# Altium project FPGA1.PrjPcb (part 1 of 2)
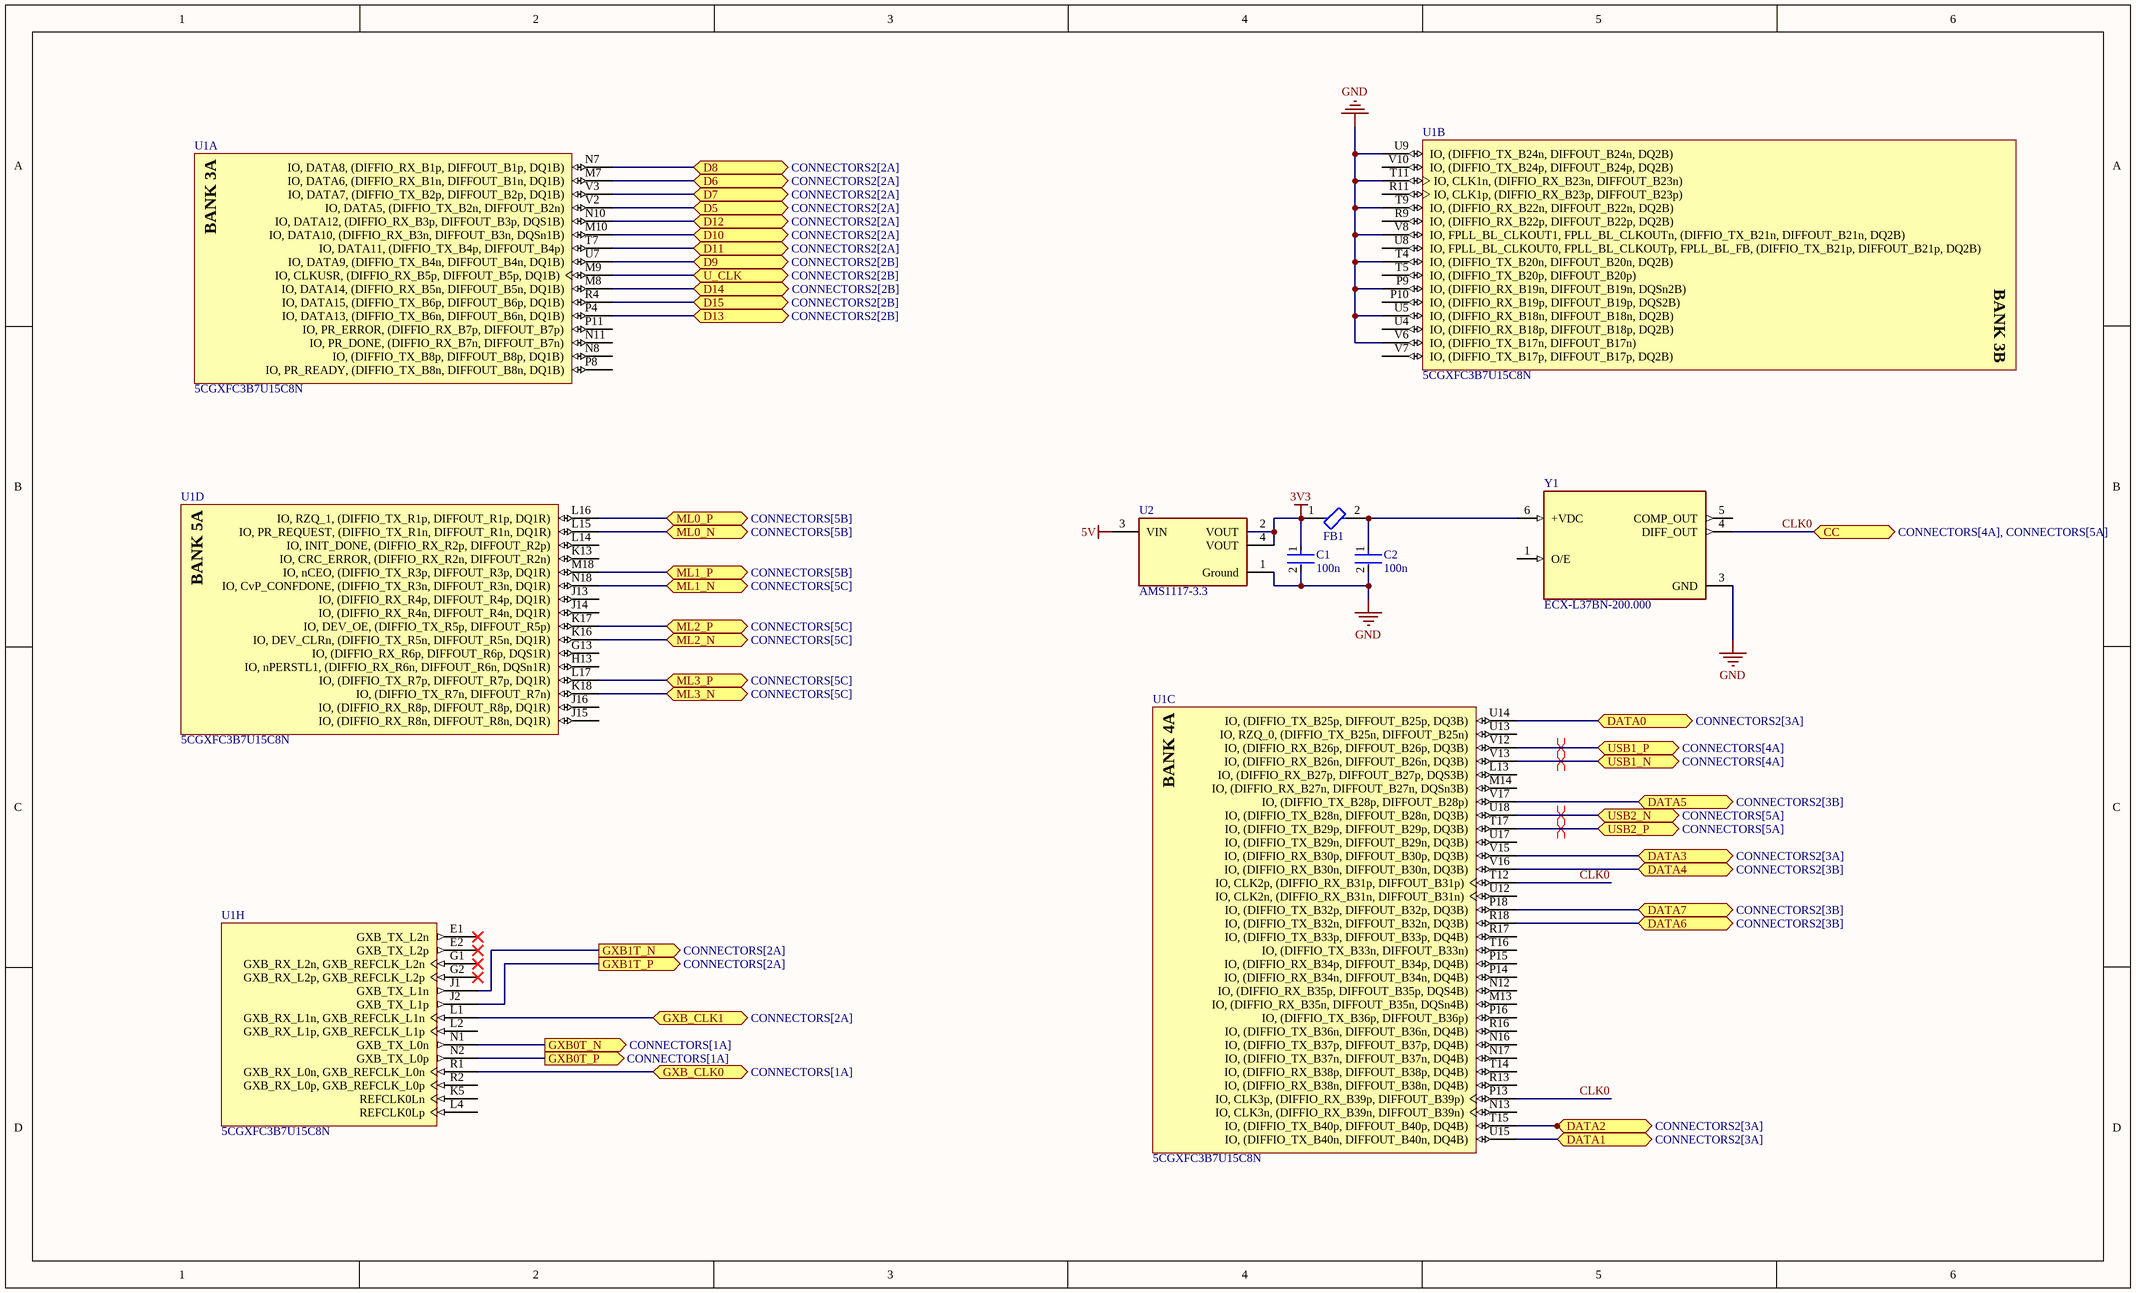
[diagram p0: IO1.SchDoc]
7 sheets, 82 parts. Net scope: flat (ports and power ports of the same name join across sheets).
Board file: cycloneV-board.PcbDoc
Sheets:
  IO1.SchDoc
  POWER1.SchDoc
  IO2.SchDoc
  CONNECTORS2.SchDoc
  sideMICRO.SchDoc
  CONNECTORS.SchDoc
  POWER0.SchDoc

## Sheet IO1.SchDoc
size 400 x 241 mm; SheetNumber: 1; SheetTotal: 7

### Parts
C1  100n  [FP-CL10-IPC_C]
C2  100n  [FP-CL10-IPC_C]
FB1  BLM18KG121TN1D  [FP-BLM18-0_15-t0_6-d1_2-IPC_A]  (value not drawn)
U1  5CGXFC3B7U15C8N  [ALTR-UBGA324_A-150]  (parts A,B,C,D,H of 12)
U2  AMS1117-3.3  [FP-AMS1117-IPC_C]
Y1  ECX-L37BN-200.000  [OSC_ECX-L37BN-200.000]

### Ports
CC (bidir, see CONNECTORS[4A], CONNECTORS[5A]), D5 (bidir, see CONNECTORS2[2A]), D6 (bidir, see CONNECTORS2[2A]), D7 (bidir, see CONNECTORS2[2A]), D8 (bidir, see CONNECTORS2[2A]), D9 (bidir, see CONNECTORS2[2B]), D10 (bidir, see CONNECTORS2[2A]), D11 (bidir, see CONNECTORS2[2A]), D12 (bidir, see CONNECTORS2[2A]), D13 (bidir, see CONNECTORS2[2B]), D14 (bidir, see CONNECTORS2[2B]), D15 (bidir, see CONNECTORS2[2B]), DATA0 (bidir, see CONNECTORS2[3A]), DATA1 (bidir, see CONNECTORS2[3A]), DATA2 (bidir, see CONNECTORS2[3A]), DATA3 (bidir, see CONNECTORS2[3A]), DATA4 (bidir, see CONNECTORS2[3B]), DATA5 (bidir, see CONNECTORS2[3B]), DATA6 (bidir, see CONNECTORS2[3B]), DATA7 (bidir, see CONNECTORS2[3B]), GXB0T_N (out, see CONNECTORS[1A]), GXB0T_P (out, see CONNECTORS[1A]), GXB1T_N (out, see CONNECTORS[2A]), GXB1T_P (out, see CONNECTORS[2A]), GXB_CLK0 (bidir, see CONNECTORS[1A]), GXB_CLK1 (bidir, see CONNECTORS[2A]), ML0_N (bidir, see CONNECTORS[5B]), ML0_P (bidir, see CONNECTORS[5B]), ML1_N (bidir, see CONNECTORS[5C]), ML1_P (bidir, see CONNECTORS[5B]), ML2_N (bidir, see CONNECTORS[5C]), ML2_P (bidir, see CONNECTORS[5C]), ML3_N (bidir, see CONNECTORS[5C]), ML3_P (bidir, see CONNECTORS[5C]), U_CLK (bidir, see CONNECTORS2[2B]), USB1_N (bidir, see CONNECTORS[4A]), USB1_P (bidir, see CONNECTORS[4A]), USB2_N (bidir, see CONNECTORS[5A]), USB2_P (bidir, see CONNECTORS[5A])

### Nets
3V3: C1.1 FB1.1 U2.2(VOUT) U2.4(VOUT)  [project net VCCIO]
5V: U2.3(VIN)
GND: C1.2 C2.2 U1.P9(IO,_(DIFFIO_RX_B19n,_DIFFOUT_B19n,_DQSn2B)) U1.T4(IO,_(DIFFIO_TX_B20n,_DIFFOUT_B20n,_DQ2B)) U1.T9(IO,_(DIFFIO_RX_B22n,_DIFFOUT_B22n,_DQ2B)) U1.T11(IO,_CLK1n,_(DIFFIO_RX_B23n,_DIFFOUT_B23n)) U1.U5(IO,_(DIFFIO_RX_B18n,_DIFFOUT_B18n,_DQ2B)) U1.U9(IO,_(DIFFIO_TX_B24n,_DIFFOUT_B24n,_DQ2B)) U1.V6(IO,_(DIFFIO_TX_B17n,_DIFFOUT_B17n)) U1.V8(IO,_FPLL_BL_CLKOUT1,_FPLL_BL_CLKOUTn,_(DIFFIO_TX_B21n,_DIFFOUT_B21n,_DQ2B)) U2.1(Ground) Y1.3(GND)
CLK0: U1.P13(IO,_CLK3p,_(DIFFIO_RX_B39p,_DIFFOUT_B39p)) U1.T12(IO,_CLK2p,_(DIFFIO_RX_B31p,_DIFFOUT_B31p)) Y1.4(DIFF_OUT) ; port CC
NetC2_1: C2.1 FB1.2 Y1.6(+VDC)
NetJ1_1: U1.P4(IO,_DATA13,_(DIFFIO_TX_B6n,_DIFFOUT_B6n,_DQ1B)) ; port D13
NetJ1_2: U1.R4(IO,_DATA15,_(DIFFIO_TX_B6p,_DIFFOUT_B6p,_DQ1B)) ; port D15
NetJ1_3: U1.M8(IO,_DATA14,_(DIFFIO_RX_B5n,_DIFFOUT_B5n,_DQ1B)) ; port D14
NetJ1_4: U1.M9(IO,_CLKUSR,_(DIFFIO_RX_B5p,_DIFFOUT_B5p,_DQ1B)) ; port U_CLK
NetJ1_5: U1.U7(IO,_DATA9,_(DIFFIO_TX_B4n,_DIFFOUT_B4n,_DQ1B)) ; port D9
NetJ1_6: U1.T7(IO,_DATA11,_(DIFFIO_TX_B4p,_DIFFOUT_B4p)) ; port D11
NetJ1_7: U1.M10(IO,_DATA10,_(DIFFIO_RX_B3n,_DIFFOUT_B3n,_DQSn1B)) ; port D10
NetJ1_8: U1.N10(IO,_DATA12,_(DIFFIO_RX_B3p,_DIFFOUT_B3p,_DQS1B)) ; port D12
NetJ1_9: U1.V2(IO,_DATA5,_(DIFFIO_TX_B2n,_DIFFOUT_B2n)) ; port D5
NetJ1_10: U1.V3(IO,_DATA7,_(DIFFIO_TX_B2p,_DIFFOUT_B2p,_DQ1B)) ; port D7
NetJ1_11: U1.M7(IO,_DATA6,_(DIFFIO_RX_B1n,_DIFFOUT_B1n,_DQ1B)) ; port D6
NetJ1_12: U1.N7(IO,_DATA8,_(DIFFIO_RX_B1p,_DIFFOUT_B1p,_DQ1B)) ; port D8
NetJ2_3: U1.U14(IO,_(DIFFIO_TX_B25p,_DIFFOUT_B25p,_DQ3B)) ; port DATA0
NetJ2_4: U1.U15(IO,_(DIFFIO_TX_B40n,_DIFFOUT_B40n,_DQ4B)) ; port DATA1
NetJ2_5: U1.T15(IO,_(DIFFIO_TX_B40p,_DIFFOUT_B40p,_DQ4B)) ; port DATA2
NetJ2_6: U1.V15(IO,_(DIFFIO_RX_B30p,_DIFFOUT_B30p,_DQ3B)) ; port DATA3
NetJ2_7: U1.V16(IO,_(DIFFIO_RX_B30n,_DIFFOUT_B30n,_DQ3B)) ; port DATA4
NetJ2_8: U1.V17(IO,_(DIFFIO_TX_B28p,_DIFFOUT_B28p)) ; port DATA5
NetJ2_9: U1.R18(IO,_(DIFFIO_TX_B32n,_DIFFOUT_B32n,_DQ3B)) ; port DATA6
NetJ2_10: U1.P18(IO,_(DIFFIO_TX_B32p,_DIFFOUT_B32p,_DQ3B)) ; port DATA7
NetJ5_A5: U1.R1(GXB_RX_L0n,_GXB_REFCLK_L0n) ; port GXB_CLK0
NetJ5_A6: U1.N2(GXB_TX_L0p) ; port GXB0T_P
NetJ5_A7: U1.N1(GXB_TX_L0n) ; port GXB0T_N
NetJ5_B5: U1.L1(GXB_RX_L1n,_GXB_REFCLK_L1n) ; port GXB_CLK1
NetJ5_B6: U1.J2(GXB_TX_L1p) ; port GXB1T_P
NetJ5_B7: U1.J1(GXB_TX_L1n) ; port GXB1T_N
NetJ6_A6: U1.V12(IO,_(DIFFIO_RX_B26p,_DIFFOUT_B26p,_DQ3B)) ; port USB1_P
NetJ6_A7: U1.V13(IO,_(DIFFIO_RX_B26n,_DIFFOUT_B26n,_DQ3B)) ; port USB1_N
NetJ6_B6: U1.T17(IO,_(DIFFIO_TX_B29p,_DIFFOUT_B29p,_DQ3B)) ; port USB2_P
NetJ6_B7: U1.U18(IO,_(DIFFIO_TX_B28n,_DIFFOUT_B28n,_DQ3B)) ; port USB2_N
NetJ7_1: U1.L16(IO,_RZQ_1,_(DIFFIO_TX_R1p,_DIFFOUT_R1p,_DQ1R)) ; port ML0_P
NetJ7_3: U1.L15(IO,_PR_REQUEST,_(DIFFIO_TX_R1n,_DIFFOUT_R1n,_DQ1R)) ; port ML0_N
NetJ7_4: U1.M18(IO,_nCEO,_(DIFFIO_TX_R3p,_DIFFOUT_R3p,_DQ1R)) ; port ML1_P
NetJ7_6: U1.N18(IO,_CvP_CONFDONE,_(DIFFIO_TX_R3n,_DIFFOUT_R3n,_DQ1R)) ; port ML1_N
NetJ7_7: U1.K17(IO,_DEV_OE,_(DIFFIO_TX_R5p,_DIFFOUT_R5p)) ; port ML2_P
NetJ7_9: U1.K16(IO,_DEV_CLRn,_(DIFFIO_TX_R5n,_DIFFOUT_R5n,_DQ1R)) ; port ML2_N
NetJ7_10: U1.L17(IO,_(DIFFIO_TX_R7p,_DIFFOUT_R7p,_DQ1R)) ; port ML3_P
NetJ7_12: U1.K18(IO,_(DIFFIO_TX_R7n,_DIFFOUT_R7n)) ; port ML3_N

Not connected (* = marked no-connect by the designer): U1 E1(GXB_TX_L2n)* E2(GXB_TX_L2p)* G1(GXB_RX_L2n,_GXB_REFCLK_L2n)* G2(GXB_RX_L2p,_GXB_REFCLK_L2p)* G13(IO,_(DIFFIO_RX_R6p,_DIFFOUT_R6p,_DQS1R)) H13(IO,_nPERSTL1,_(DIFFIO_RX_R6n,_DIFFOUT_R6n,_DQSn1R)) J13(IO,_(DIFFIO_RX_R4p,_DIFFOUT_R4p,_DQ1R)) J14(IO,_(DIFFIO_RX_R4n,_DIFFOUT_R4n,_DQ1R)) J15(IO,_(DIFFIO_RX_R8n,_DIFFOUT_R8n,_DQ1R)) J16(IO,_(DIFFIO_RX_R8p,_DIFFOUT_R8p,_DQ1R)) K5(REFCLK0Ln) K13(IO,_CRC_ERROR,_(DIFFIO_RX_R2n,_DIFFOUT_R2n)) L2(GXB_RX_L1p,_GXB_REFCLK_L1p) L4(REFCLK0Lp) L13(IO,_(DIFFIO_RX_B27p,_DIFFOUT_B27p,_DQS3B)) L14(IO,_INIT_DONE,_(DIFFIO_RX_R2p,_DIFFOUT_R2p)) M13(IO,_(DIFFIO_RX_B35n,_DIFFOUT_B35n,_DQSn4B)) M14(IO,_(DIFFIO_RX_B27n,_DIFFOUT_B27n,_DQSn3B)) N8(IO,_(DIFFIO_TX_B8p,_DIFFOUT_B8p,_DQ1B)) N11(IO,_PR_DONE,_(DIFFIO_RX_B7n,_DIFFOUT_B7n)) N12(IO,_(DIFFIO_RX_B35p,_DIFFOUT_B35p,_DQS4B)) N13(IO,_CLK3n,_(DIFFIO_RX_B39n,_DIFFOUT_B39n)) N16(IO,_(DIFFIO_TX_B37p,_DIFFOUT_B37p,_DQ4B)) N17(IO,_(DIFFIO_TX_B37n,_DIFFOUT_B37n,_DQ4B)) P8(IO,_PR_READY,_(DIFFIO_TX_B8n,_DIFFOUT_B8n,_DQ1B)) P10(IO,_(DIFFIO_RX_B19p,_DIFFOUT_B19p,_DQS2B)) P11(IO,_PR_ERROR,_(DIFFIO_RX_B7p,_DIFFOUT_B7p)) P14(IO,_(DIFFIO_RX_B34n,_DIFFOUT_B34n,_DQ4B)) P15(IO,_(DIFFIO_RX_B34p,_DIFFOUT_B34p,_DQ4B)) P16(IO,_(DIFFIO_TX_B36p,_DIFFOUT_B36p)) R2(GXB_RX_L0p,_GXB_REFCLK_L0p) R9(IO,_(DIFFIO_RX_B22p,_DIFFOUT_B22p,_DQ2B)) R11(IO,_CLK1p,_(DIFFIO_RX_B23p,_DIFFOUT_B23p)) R13(IO,_(DIFFIO_RX_B38n,_DIFFOUT_B38n,_DQ4B)) R16(IO,_(DIFFIO_TX_B36n,_DIFFOUT_B36n,_DQ4B)) R17(IO,_(DIFFIO_TX_B33p,_DIFFOUT_B33p,_DQ4B)) T5(IO,_(DIFFIO_TX_B20p,_DIFFOUT_B20p)) T14(IO,_(DIFFIO_RX_B38p,_DIFFOUT_B38p,_DQ4B)) T16(IO,_(DIFFIO_TX_B33n,_DIFFOUT_B33n)) U4(IO,_(DIFFIO_RX_B18p,_DIFFOUT_B18p,_DQ2B)) U8(IO,_FPLL_BL_CLKOUT0,_FPLL_BL_CLKOUTp,_FPLL_BL_FB,_(DIFFIO_TX_B21p,_DIFFOUT_B21p,_DQ2B)) U12(IO,_CLK2n,_(DIFFIO_RX_B31n,_DIFFOUT_B31n)) U13(IO,_RZQ_0,_(DIFFIO_TX_B25n,_DIFFOUT_B25n)) U17(IO,_(DIFFIO_TX_B29n,_DIFFOUT_B29n,_DQ3B)) V7(IO,_(DIFFIO_TX_B17p,_DIFFOUT_B17p,_DQ2B)) V10(IO,_(DIFFIO_TX_B24p,_DIFFOUT_B24p,_DQ2B)); Y1 1(O/E) 5(COMP_OUT)

### Layout directives
differential pair: NetJ6_A6, NetJ6_A7, NetJ6_B6, NetJ6_B7

### Notes on the sheet
- (in symbol CMP-0469-00059-2, part A) BANK 3A
- (in symbol CMP-0469-00059-2, part B) BANK 3B
- (in symbol CMP-0469-00059-2, part C) BANK 4A
- (in symbol CMP-0469-00059-2, part D) BANK 5A

### Library data of the parts
C1 C2 = CMP-13271-003017-1: Cap Ceramic 4.7uF 10V X5R ±10% Pad SMD 0603 +85°C T/R; Capacitance: 4.7uF; Case/Package: 0603; Packaging: Tape and Reel; Width: 0.031inch; Contact Plating: Tin; Thickness: 0.035inch; Package Quantity: 1; Voltage Rating: 10V; Case Code (Metric): 1608; Case Code (Imperial): 0603; Depth: 0.8mm; Height: 0.8mm; Tolerance: 10%; Max Operating Temperature: 85°C; Length: 1.6mm; Dielectric: X5R; Mount: Surface Mount; Radiation Hardening: No; Min Operating Temperature: -55°C
FB1 = CMP-0686-00554-8: FERRITE BEAD 120 OHM 0603 1LN; Max Current Rating: 3A; DC Resistance (DCR): 30mR; Impedance: 120R; Number of Lines: 1; Test Frequency: 100MHz; Tolerance: 25%; Package Quantity: 4000; Min Operating Temperature: -55°C; Termination: SMD/SMT; REACH SVHC: No SVHC; Core Material: Ferrite; Material: Ferrite; Current Rating: 3A; Height: 0.8mm; Number of Pins: 2; Case/Package: 0603; Case Code (Imperial): 0603; Series: BLM18K; Packaging: Tape and Reel; Inductor Type: FERRITE BEAD; Lead Free: Lead Free; Width: 0.8mm; Case Code (Metric): 1608; Number of Circuits: 1; Max DC Current: 3A; Depth: 0.95mm; Max Operating Temperature: 125°C; Length: 1.6mm; RoHS Compliant: Yes
U1 = CMP-0469-00059-2: Cyclone V GX Family FPGA, 1.07 to 1.13 V Supply, 144 I/O Pins, 4 PLLs, 324-Pin UBGA, Speed Grade 8, Commercial Grade, RoHS Compliant; Manufacturer: Altera; Logic Elements (LE) (K): 31.5; GPIO: 144; Speed Grade: 8; ComponentLink1Description: Manufacturer URL; ComponentLink5URL: http://www.altera.com/literature/dp/cyclone-v/5CGXFC3.xls; ComponentLink7URL: http://www.buyaltera.com/scripts/partsearch.dll?Detail&name=544-2758-ND; Subcategory: Cyclone V GX; ComponentLink2Description: Datasheet; Voltage Supply: 1.07 to 1.13 V; PackageVersion: Rev. 1.0, 10/2011; ComponentLink7Description: Product URL; ComponentLink4Description: Device Handbook URL; Mounting Technology: Surface Mount; ComponentLink3URL: http://www.altera.com/devicepackaging/04R00433-00.pdf; Code_JEDEC: MO-216-BAK-1; ComponentLink1URL: http://www.altera.com; ComponentLink3Description: Package Specification; Device Group: 5CGXFC3; ComponentLink6URL: http://www.altera.com/literature/hb/cyclone-v/cv_51001.pdf; ComponentLink4URL: http://www.altera.com/literature/hb/cyclone-v/cyclone5_handbook.pdf; PackageDescription: 324-Pin Ultra FineLine Ball-Grid Array (UBGA), Body 15 x 15 mm, Pitch 0.8 mm; RoHS: RoHS Compliant; PackageReference: UBGA324_A-150; DatasheetVersion: Rev. 3.4; PartNumber: 5CGXFC3B7U15C8N; ComponentLink2URL: http://www.altera.com/literature/hb/cyclone-v/cv_51002.pdf; ComponentLink6Description: Device Overview URL; ComponentLink5Description: Device Pin-Out URL; NexusDeviceID: 5CGXFC3B7U15C8N
U2 = CMP-209535-000001-1: LDO Voltage Regulators 1A, 3.3V; Manufacturer: Advanced Monolithic Systems; Dropout Voltage: 1.1V; Output Type: Fixed; Nominal Supply Current: 5mA; Max Power Dissipation: 1.2W; Max Supply Voltage: 15V; Number Of Outputs: 1; Standoff Height: 0.64mm; Max Junction Temp: +125°C; Height: 1.8mm; Package: AMS1117; Device Class L2: Power Management ICs; ComponentLink2Description: Datasheet; ComponentLink2URL: http://www.advanced-monolithic.com/pdf/ds1117.pdf; Category: IC; RoHS: TRUE; Automotive: No; Device Class L1: Integrated Circuits (ICs); Output Current: 1A; Device Class L3: Voltage Regulators - Linear; Temperature: -40°C to +125°C; Output Voltage: 3.3V; Manufacturer Part Number: AMS1117-3.3; Temperature Range Low: -40°C; Octopart: https://octopart.com/ams1117-3.3-advanced+monolithic+systems-25899300; Lead Free: Yes; Ipc Land Pattern Name: SOT229P700X180-4; Temperature Range High: +125°C
Y1 = ECX-L37BN-200.000: 200 MHz XO (Standard) LVDS Oscillator 3.3V Enable/Disable 6-SMD, No Lead; MF: ECS Inc.; MP: ECX-L37BN-200.000; Package: SMD-6 ECS International; Purchase-URL: https://pricing.snapeda.com/search/part/ECX-L37BN-200.000/?ref=eda; Price: None; Value: *; SnapEDA_Link: https://www.snapeda.com/parts/ECX-L37BN-200.000/ECS+Inc./view-part/?ref=snap; Check_prices: https://www.snapeda.com/parts/ECX-L37BN-200.000/ECS+Inc./view-part/?ref=eda; Availability: In Stock

## Sheet POWER1.SchDoc
size A; SheetNumber: 2; SheetTotal: 7
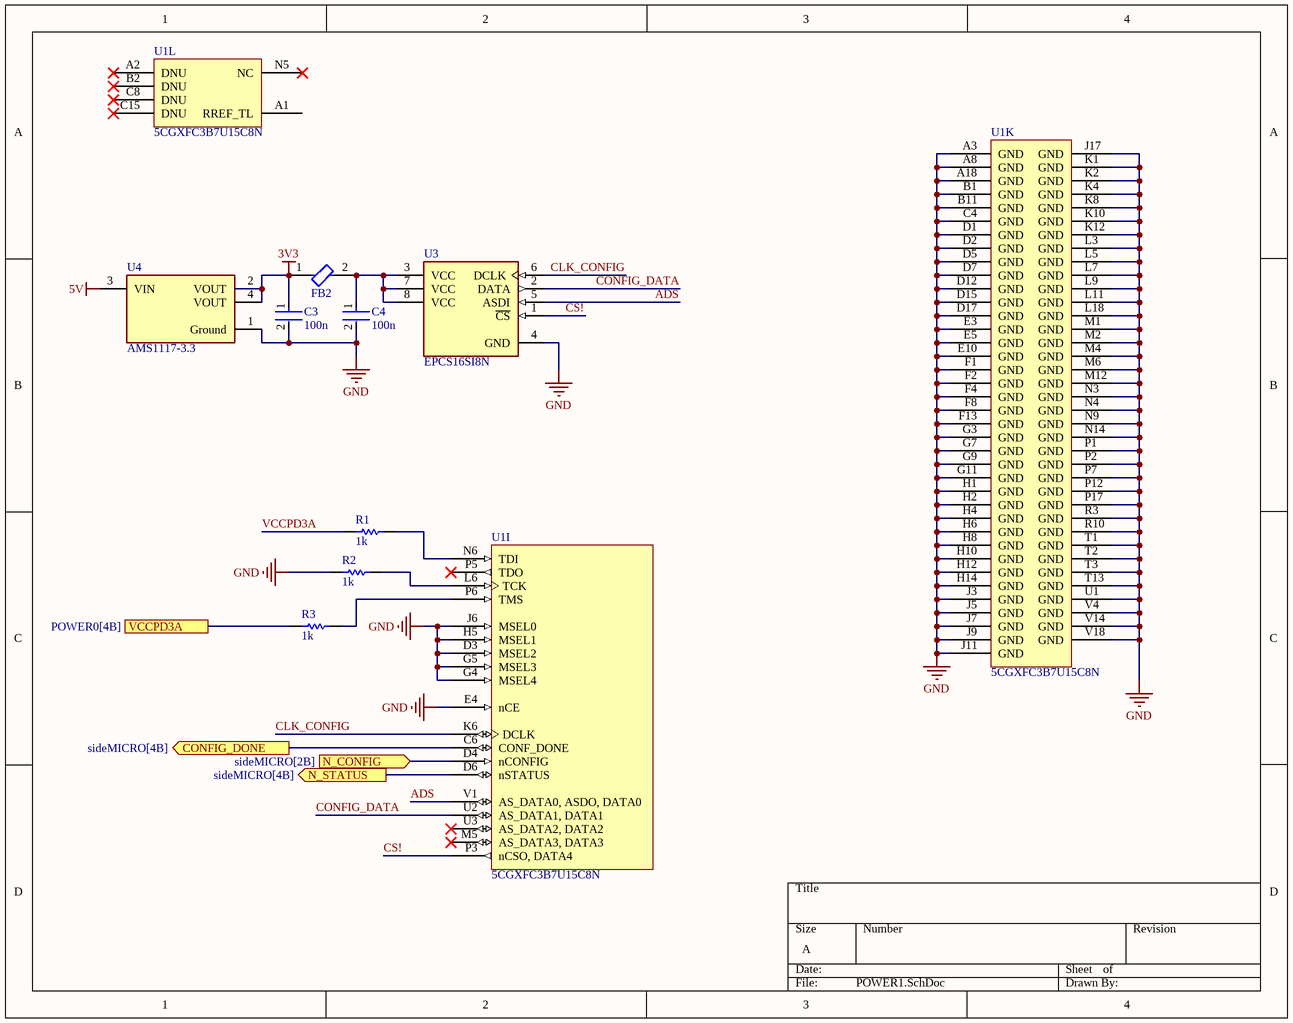
[diagram p1: POWER1.SchDoc]

### Parts
C3  100n  [FP-CL10-IPC_C]
C4  100n  [FP-CL10-IPC_C]
FB2  BLM18KG121TN1D  [FP-BLM18-0_15-t0_6-d1_2-IPC_A]  (value not drawn)
R1  1k  [RESC2013X60X35ML10T20]
R2  1k  [RESC2013X60X35ML10T20]
R3  1k  [RESC2013X60X35ML10T20]
U1  5CGXFC3B7U15C8N  [ALTR-UBGA324_A-150]  (parts I,K,L of 12)
U3  EPCS16SI8N  [FP-SOIC-8-IPC_C]
U4  AMS1117-3.3  [FP-AMS1117-IPC_C]

### Ports
CONFIG_DONE (out, see sideMICRO[4B]), N_CONFIG (in, see sideMICRO[2B]), N_STATUS (out, see sideMICRO[4B]), VCCPD3A (see POWER0[4B])

### Nets
3V3: C3.1 FB2.1 U4.2(VOUT) U4.4(VOUT)  [project net VCCIO]
5V: U4.3(VIN)
GND: C3.2 C4.2 R2.1 U1.A3(GND) U1.A8(GND) U1.A18(GND) U1.B1(GND) U1.B11(GND) U1.C4(GND) U1.D1(GND) U1.D2(GND) U1.D3(MSEL2) U1.D5(GND) U1.D7(GND) U1.D12(GND) U1.D15(GND) U1.D17(GND) U1.E3(GND) U1.E4(nCE) U1.E5(GND) U1.E10(GND) U1.F1(GND) U1.F2(GND) U1.F4(GND) U1.F8(GND) U1.F13(GND) U1.G3(GND) U1.G4(MSEL4) U1.G5(MSEL3) U1.G7(GND) U1.G9(GND) U1.G11(GND) U1.H1(GND) U1.H2(GND) U1.H4(GND) U1.H5(MSEL1) U1.H6(GND) U1.H8(GND) U1.H10(GND) U1.H12(GND) U1.H14(GND) U1.J3(GND) U1.J5(GND) U1.J6(MSEL0) U1.J7(GND) U1.J9(GND) U1.J11(GND) U1.J17(GND) U1.K1(GND) U1.K2(GND) U1.K4(GND) U1.K8(GND) U1.K10(GND) U1.K12(GND) U1.L3(GND) U1.L5(GND) U1.L7(GND) U1.L9(GND) U1.L11(GND) U1.L18(GND) U1.M1(GND) U1.M2(GND) U1.M4(GND) U1.M6(GND) U1.M12(GND) U1.N3(GND) U1.N4(GND) U1.N9(GND) U1.N14(GND) U1.P1(GND) U1.P2(GND) U1.P7(GND) U1.P12(GND) U1.P17(GND) U1.R3(GND) U1.R10(GND) U1.T1(GND) U1.T2(GND) U1.T3(GND) U1.T13(GND) U1.U1(GND) U1.V4(GND) U1.V14(GND) U1.V18(GND) U3.4(GND) U4.1(Ground)
ADS: U1.V1(AS_DATA0,_ASDO,_DATA0) U3.5(ASDI)
CLK_CONFIG: U1.K6(DCLK) U3.6(DCLK)
CONFIG_DATA: U1.U2(AS_DATA1,_DATA1) U3.2(DATA)
CS!: U1.P3(nCSO,_DATA4) U3.1(~{CS})
VCCPD3A: R1.1
NetC4_1: C4.1 FB2.2 U3.3(VCC) U3.7(VCC) U3.8(VCC)
NetR1_2: R1.2 U1.N6(TDI)
NetR2_2: R2.2 U1.L6(TCK)
NetR3_1: R3.1 ; port VCCPD3A
NetR3_2: R3.2 U1.P6(TMS)
NetU1_C6: U1.C6(CONF_DONE) ; port CONFIG_DONE
NetU1_D4: U1.D4(nCONFIG) ; port N_CONFIG
NetU1_D6: U1.D6(nSTATUS) ; port N_STATUS

Not connected (* = marked no-connect by the designer): U1 A1(RREF_TL) A2(DNU)* B2(DNU)* C8(DNU)* C15(DNU)* M5(AS_DATA3,_DATA3)* N5(NC)* P5(TDO)* U3(AS_DATA2,_DATA2)*

### Library data of the parts
C3 C4 = CMP-13271-003017-1: as C1 on sheet IO1; Capacitance: 4.7uF; Case/Package: 0603; Packaging: Tape and Reel; Width: 0.031inch; Contact Plating: Tin; Thickness: 0.035inch; Package Quantity: 1; Voltage Rating: 10V; Case Code (Metric): 1608; Case Code (Imperial): 0603; Depth: 0.8mm; Height: 0.8mm; Tolerance: 10%; Max Operating Temperature: 85°C; Length: 1.6mm; Dielectric: X5R; Mount: Surface Mount; Radiation Hardening: No; Min Operating Temperature: -55°C
FB2 = CMP-0686-00554-8: as FB1 on sheet IO1; Package Quantity: 4000; Min Operating Temperature: -55°C; Termination: SMD/SMT; REACH SVHC: No SVHC; Core Material: Ferrite; Material: Ferrite; Current Rating: 3A; Height: 0.8mm; Number of Pins: 2; Case/Package: 0603; Case Code (Imperial): 0603; Series: BLM18K; Packaging: Tape and Reel; Inductor Type: FERRITE BEAD; Lead Free: Lead Free; Width: 0.8mm; Case Code (Metric): 1608; Number of Circuits: 1; Max DC Current: 3A; Depth: 0.95mm; Max Operating Temperature: 125°C; Length: 1.6mm; RoHS Compliant: Yes
R1-R3 = CMP-2100-03673-1: Chip Resistor, 0 Ohm, Jumper, +/- 5%, 0.125 W, -55 to 155 degC, 0805 (2012 Metric), RoHS, Tape and Reel; Manufacturer: Yageo; Power Rating: 125mW; Resistance: 0mOhm; Voltage Rating (DC): 150V; Temperature Coefficient: 200ppm/degreesC; Height: 0.5mm; Depth: 1.25mm; Case Code (Imperial): 0805; Lead Free: LeadFree; Military Standard: Not; Package Description: 2-Pin Surface Mounted Device, Body 2 x 1.25 mm; Case Code (Metric): 2012; Composition: ThickFilm; Voltage Rating: 150V; Manufacturer URL: http://www.yageo.com/; Packaging: TapeandReel; Package Reference: 0805; REACH SVHC: Unknown; Tolerance: 5%; Case/Package: 0805; Max Operating Temperature: 155degC; Number of Pins: 2; Min Operating Temperature: -55degC; RoHSCompliant: true; Length: 2mm; Datasheet URL: http://www.yageo.com/NewPortal/yageodocoutput?fileName=/pdf/R-Chip/PYu-RC_Group_51_RoHS_L_5.pdf; Termination: SMD/SMT; Radiation Hardening: No; Width: 1.25mm; Contact Plating: Tin; Datasheet Version: Rev. 5, 10/2016
U1 = CMP-0469-00059-2: as U1 on sheet IO1; ComponentLink1Description: Manufacturer URL; ComponentLink5URL: http://www.altera.com/literature/dp/cyclone-v/5CGXFC3.xls; ComponentLink7URL: http://www.buyaltera.com/scripts/partsearch.dll?Detail&name=544-2758-ND; Subcategory: Cyclone V GX; ComponentLink2Description: Datasheet; Voltage Supply: 1.07 to 1.13 V; PackageVersion: Rev. 1.0, 10/2011; ComponentLink7Description: Product URL; ComponentLink4Description: Device Handbook URL; Mounting Technology: Surface Mount; ComponentLink3URL: http://www.altera.com/devicepackaging/04R00433-00.pdf; Code_JEDEC: MO-216-BAK-1; ComponentLink1URL: http://www.altera.com; ComponentLink3Description: Package Specification; Device Group: 5CGXFC3; ComponentLink6URL: http://www.altera.com/literature/hb/cyclone-v/cv_51001.pdf; ComponentLink4URL: http://www.altera.com/literature/hb/cyclone-v/cyclone5_handbook.pdf; PackageDescription: 324-Pin Ultra FineLine Ball-Grid Array (UBGA), Body 15 x 15 mm, Pitch 0.8 mm; RoHS: RoHS Compliant; PackageReference: UBGA324_A-150; DatasheetVersion: Rev. 3.4; PartNumber: 5CGXFC3B7U15C8N; ComponentLink2URL: http://www.altera.com/literature/hb/cyclone-v/cv_51002.pdf; ComponentLink6Description: Device Overview URL; ComponentLink5Description: Device Pin-Out URL; NexusDeviceID: 5CGXFC3B7U15C8N
U3 = CMP-0215-00002-2: IC CONFIG DEVICE 16MBIT 8SOIC; Manufacturer: Intel; Obsolete Part: true; Interface: Other; Memory Type: FLASH; Nominal Supply Current: 15-20mA; Min Supply Voltage: 2.7V; Memory Size: 16Mbits; Max Junction Temp: +135°C; Standoff Height: 0.1mm; Frequency: 40MHz; Max Supply Voltage: 3.6V; Device Class L1: Integrated Circuits (ICs); Ambient Temperature Range Low: -40°C; Automotive: No; Ipc Land Pattern Name: SOIC127P600X155-8; Lead Free: Yes; Height: 1.75mm; Device Class L3: Flash; Temperature Range High: +135°C; Ambient Temperature Range High: +85°C; Manufacturer Part Number: EPCS16SI8N; ComponentLink2URL: https://www.intel.com/content/dam/www/programmable/us/en/pdfs/literature/hb/cfg/cyc_c51014.pdf; RoHS: TRUE; ComponentLink2Description: Datasheet; Digikey Description: IC CONFIG DEVICE 16MBIT 8SOIC; Octopart: https://octopart.com/epcs16si8n-intel-80907697; Package: SOIC-8; Temperature: to +135°C; Device Class L2: Memory; Footprint Url: https://www.intel.com/content/dam/www/programmable/us/en/pdfs/literature/packaging/04r00424-00.pdf; Category: IC; Mouser Description: FPGA - Configuration Memory IC - Ser. Config Mem Flash 16Mb 40 MHz
U4 = CMP-209535-000001-1: as U2 on sheet IO1; Height: 1.8mm; Package: AMS1117; Device Class L2: Power Management ICs; ComponentLink2Description: Datasheet; ComponentLink2URL: http://www.advanced-monolithic.com/pdf/ds1117.pdf; Category: IC; RoHS: TRUE; Automotive: No; Device Class L1: Integrated Circuits (ICs); Output Current: 1A; Device Class L3: Voltage Regulators - Linear; Temperature: -40°C to +125°C; Output Voltage: 3.3V; Manufacturer Part Number: AMS1117-3.3; Temperature Range Low: -40°C; Octopart: https://octopart.com/ams1117-3.3-advanced+monolithic+systems-25899300; Lead Free: Yes; Ipc Land Pattern Name: SOT229P700X180-4; Temperature Range High: +125°C

## Sheet IO2.SchDoc
size 359 x 219 mm; SheetNumber: 3; SheetTotal: 7
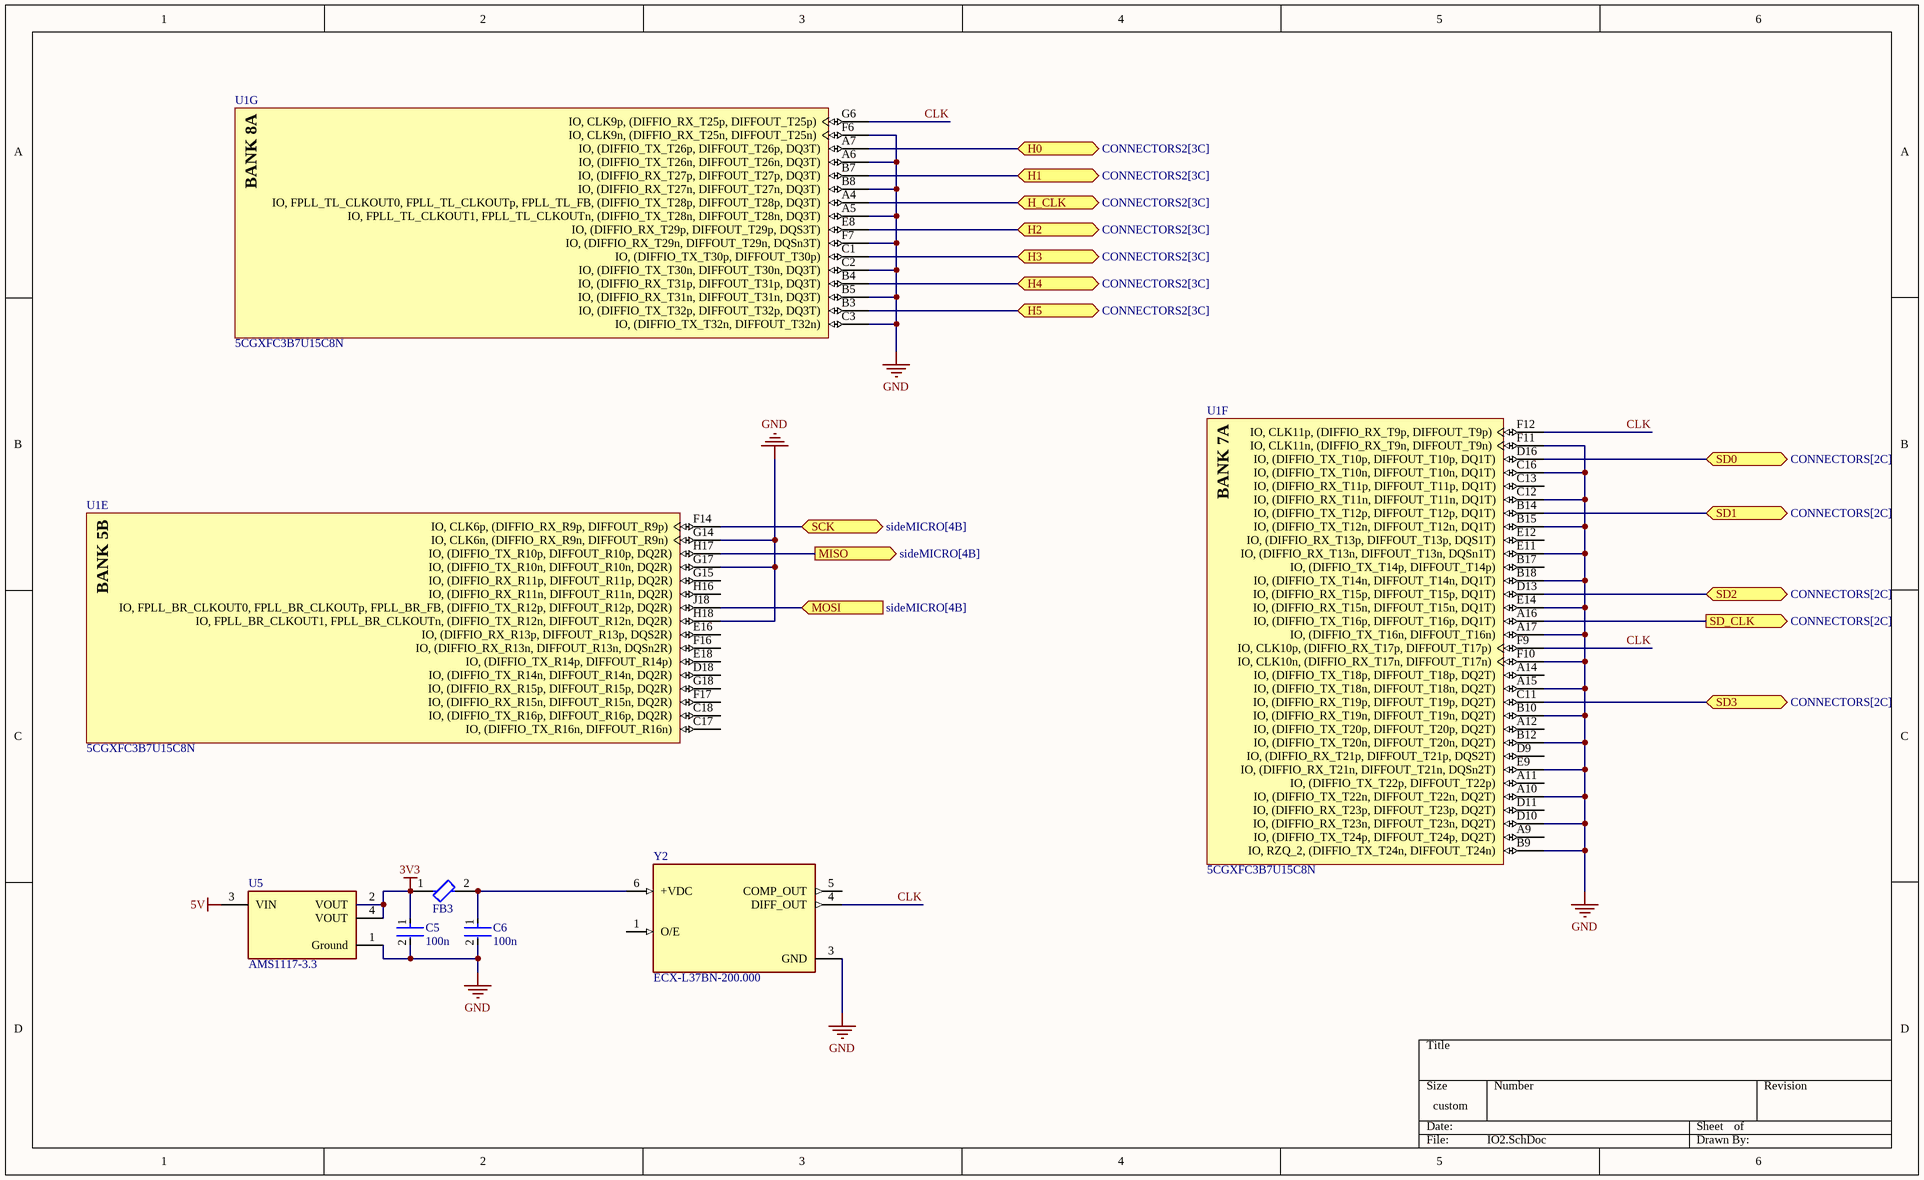
[diagram p2: IO2.SchDoc]

### Parts
C5  100n  [FP-CL10-IPC_C]
C6  100n  [FP-CL10-IPC_C]
FB3  BLM18KG121TN1D  [FP-BLM18-0_15-t0_6-d1_2-IPC_A]  (value not drawn)
U1  5CGXFC3B7U15C8N  [ALTR-UBGA324_A-150]  (parts E,F,G of 12)
U5  AMS1117-3.3  [FP-AMS1117-IPC_C]
Y2  ECX-L37BN-200.000  [OSC_ECX-L37BN-200.000]

### Ports
H0 (bidir, see CONNECTORS2[3C]), H1 (bidir, see CONNECTORS2[3C]), H2 (bidir, see CONNECTORS2[3C]), H3 (bidir, see CONNECTORS2[3C]), H4 (bidir, see CONNECTORS2[3C]), H5 (bidir, see CONNECTORS2[3C]), H_CLK (bidir, see CONNECTORS2[3C]), MISO (out, see sideMICRO[4B]), MOSI (in, see sideMICRO[4B]), SCK (bidir, see sideMICRO[4B]), SD0 (bidir, see CONNECTORS[2C]), SD1 (bidir, see CONNECTORS[2C]), SD2 (bidir, see CONNECTORS[2C]), SD3 (bidir, see CONNECTORS[2C]), SD_CLK (out, see CONNECTORS[2C])

### Nets
3V3: C5.1 FB3.1 U5.2(VOUT) U5.4(VOUT)  [project net VCCIO]
5V: U5.3(VIN)
GND: C5.2 C6.2 U1.A5(IO,_FPLL_TL_CLKOUT1,_FPLL_TL_CLKOUTn,_(DIFFIO_TX_T28n,_DIFFOUT_T28n,_DQ3T)) U1.A6(IO,_(DIFFIO_TX_T26n,_DIFFOUT_T26n,_DQ3T)) U1.A10(IO,_(DIFFIO_TX_T22n,_DIFFOUT_T22n,_DQ2T)) U1.A15(IO,_(DIFFIO_TX_T18n,_DIFFOUT_T18n,_DQ2T)) U1.A17(IO,_(DIFFIO_TX_T16n,_DIFFOUT_T16n)) U1.B5(IO,_(DIFFIO_RX_T31n,_DIFFOUT_T31n,_DQ3T)) U1.B8(IO,_(DIFFIO_RX_T27n,_DIFFOUT_T27n,_DQ3T)) U1.B9(IO,_RZQ_2,_(DIFFIO_TX_T24n,_DIFFOUT_T24n)) U1.B10(IO,_(DIFFIO_RX_T19n,_DIFFOUT_T19n,_DQ2T)) U1.B12(IO,_(DIFFIO_TX_T20n,_DIFFOUT_T20n,_DQ2T)) U1.B15(IO,_(DIFFIO_TX_T12n,_DIFFOUT_T12n,_DQ1T)) U1.B18(IO,_(DIFFIO_TX_T14n,_DIFFOUT_T14n,_DQ1T)) U1.C2(IO,_(DIFFIO_TX_T30n,_DIFFOUT_T30n,_DQ3T)) U1.C3(IO,_(DIFFIO_TX_T32n,_DIFFOUT_T32n)) U1.C12(IO,_(DIFFIO_RX_T11n,_DIFFOUT_T11n,_DQ1T)) U1.C16(IO,_(DIFFIO_TX_T10n,_DIFFOUT_T10n,_DQ1T)) U1.D10(IO,_(DIFFIO_RX_T23n,_DIFFOUT_T23n,_DQ2T)) U1.E9(IO,_(DIFFIO_RX_T21n,_DIFFOUT_T21n,_DQSn2T)) U1.E11(IO,_(DIFFIO_RX_T13n,_DIFFOUT_T13n,_DQSn1T)) U1.E14(IO,_(DIFFIO_RX_T15n,_DIFFOUT_T15n,_DQ1T)) U1.F6(IO,_CLK9n,_(DIFFIO_RX_T25n,_DIFFOUT_T25n)) U1.F7(IO,_(DIFFIO_RX_T29n,_DIFFOUT_T29n,_DQSn3T)) U1.F10(IO,_CLK10n,_(DIFFIO_RX_T17n,_DIFFOUT_T17n)) U1.F11(IO,_CLK11n,_(DIFFIO_RX_T9n,_DIFFOUT_T9n)) U1.G14(IO,_CLK6n,_(DIFFIO_RX_R9n,_DIFFOUT_R9n)) U1.G17(IO,_(DIFFIO_TX_R10n,_DIFFOUT_R10n,_DQ2R)) U1.H18(IO,_FPLL_BR_CLKOUT1,_FPLL_BR_CLKOUTn,_(DIFFIO_TX_R12n,_DIFFOUT_R12n,_DQ2R)) U5.1(Ground) Y2.3(GND)
CLK: U1.F9(IO,_CLK10p,_(DIFFIO_RX_T17p,_DIFFOUT_T17p)) U1.F12(IO,_CLK11p,_(DIFFIO_RX_T9p,_DIFFOUT_T9p)) U1.G6(IO,_CLK9p,_(DIFFIO_RX_T25p,_DIFFOUT_T25p)) Y2.4(DIFF_OUT)
NetC6_1: C6.1 FB3.2 Y2.6(+VDC)
NetJ4_3: U1.A4(IO,_FPLL_TL_CLKOUT0,_FPLL_TL_CLKOUTp,_FPLL_TL_FB,_(DIFFIO_TX_T28p,_DIFFOUT_T28p,_DQ3T)) ; port H_CLK
NetJ4_4: U1.A7(IO,_(DIFFIO_TX_T26p,_DIFFOUT_T26p,_DQ3T)) ; port H0
NetJ4_5: U1.B7(IO,_(DIFFIO_RX_T27p,_DIFFOUT_T27p,_DQ3T)) ; port H1
NetJ4_6: U1.E8(IO,_(DIFFIO_RX_T29p,_DIFFOUT_T29p,_DQS3T)) ; port H2
NetJ4_7: U1.C1(IO,_(DIFFIO_TX_T30p,_DIFFOUT_T30p)) ; port H3
NetJ4_8: U1.B4(IO,_(DIFFIO_RX_T31p,_DIFFOUT_T31p,_DQ3T)) ; port H4
NetJ4_9: U1.B3(IO,_(DIFFIO_TX_T32p,_DIFFOUT_T32p,_DQ3T)) ; port H5
NetJ8_1: U1.D13(IO,_(DIFFIO_RX_T15p,_DIFFOUT_T15p,_DQ1T)) ; port SD2
NetJ8_2: U1.C11(IO,_(DIFFIO_RX_T19p,_DIFFOUT_T19p,_DQ2T)) ; port SD3
NetJ8_5: U1.A16(IO,_(DIFFIO_TX_T16p,_DIFFOUT_T16p,_DQ1T)) ; port SD_CLK
NetJ8_7: U1.D16(IO,_(DIFFIO_TX_T10p,_DIFFOUT_T10p,_DQ1T)) ; port SD0
NetJ8_8: U1.B14(IO,_(DIFFIO_TX_T12p,_DIFFOUT_T12p,_DQ1T)) ; port SD1
NetU1_F14: U1.F14(IO,_CLK6p,_(DIFFIO_RX_R9p,_DIFFOUT_R9p)) ; port SCK
NetU1_H17: U1.H17(IO,_(DIFFIO_TX_R10p,_DIFFOUT_R10p,_DQ2R)) ; port MISO
NetU1_J18: U1.J18(IO,_FPLL_BR_CLKOUT0,_FPLL_BR_CLKOUTp,_FPLL_BR_FB,_(DIFFIO_TX_R12p,_DIFFOUT_R12p,_DQ2R)) ; port MOSI

Not connected (* = marked no-connect by the designer): U1 A9(IO,_(DIFFIO_TX_T24p,_DIFFOUT_T24p,_DQ2T)) A11(IO,_(DIFFIO_TX_T22p,_DIFFOUT_T22p)) A12(IO,_(DIFFIO_TX_T20p,_DIFFOUT_T20p,_DQ2T)) A14(IO,_(DIFFIO_TX_T18p,_DIFFOUT_T18p,_DQ2T)) B17(IO,_(DIFFIO_TX_T14p,_DIFFOUT_T14p)) C13(IO,_(DIFFIO_RX_T11p,_DIFFOUT_T11p,_DQ1T)) C17(IO,_(DIFFIO_TX_R16n,_DIFFOUT_R16n)) C18(IO,_(DIFFIO_TX_R16p,_DIFFOUT_R16p,_DQ2R)) D9(IO,_(DIFFIO_RX_T21p,_DIFFOUT_T21p,_DQS2T)) D11(IO,_(DIFFIO_RX_T23p,_DIFFOUT_T23p,_DQ2T)) D18(IO,_(DIFFIO_TX_R14n,_DIFFOUT_R14n,_DQ2R)) E12(IO,_(DIFFIO_RX_T13p,_DIFFOUT_T13p,_DQS1T)) E16(IO,_(DIFFIO_RX_R13p,_DIFFOUT_R13p,_DQS2R)) E18(IO,_(DIFFIO_TX_R14p,_DIFFOUT_R14p)) F16(IO,_(DIFFIO_RX_R13n,_DIFFOUT_R13n,_DQSn2R)) F17(IO,_(DIFFIO_RX_R15n,_DIFFOUT_R15n,_DQ2R)) G15(IO,_(DIFFIO_RX_R11p,_DIFFOUT_R11p,_DQ2R)) G18(IO,_(DIFFIO_RX_R15p,_DIFFOUT_R15p,_DQ2R)) H16(IO,_(DIFFIO_RX_R11n,_DIFFOUT_R11n,_DQ2R)); Y2 1(O/E) 5(COMP_OUT)

### Notes on the sheet
- (in symbol CMP-0469-00059-2, part E) BANK 5B
- (in symbol CMP-0469-00059-2, part F) BANK 7A
- (in symbol CMP-0469-00059-2, part G) BANK 8A

### Library data of the parts
C5 C6 = CMP-13271-003017-1: as C1 on sheet IO1; Capacitance: 4.7uF; Case/Package: 0603; Packaging: Tape and Reel; Width: 0.031inch; Contact Plating: Tin; Thickness: 0.035inch; Package Quantity: 1; Voltage Rating: 10V; Case Code (Metric): 1608; Case Code (Imperial): 0603; Depth: 0.8mm; Height: 0.8mm; Tolerance: 10%; Max Operating Temperature: 85°C; Length: 1.6mm; Dielectric: X5R; Mount: Surface Mount; Radiation Hardening: No; Min Operating Temperature: -55°C
FB3 = CMP-0686-00554-8: as FB1 on sheet IO1; Package Quantity: 4000; Min Operating Temperature: -55°C; Termination: SMD/SMT; REACH SVHC: No SVHC; Core Material: Ferrite; Material: Ferrite; Current Rating: 3A; Height: 0.8mm; Number of Pins: 2; Case/Package: 0603; Case Code (Imperial): 0603; Series: BLM18K; Packaging: Tape and Reel; Inductor Type: FERRITE BEAD; Lead Free: Lead Free; Width: 0.8mm; Case Code (Metric): 1608; Number of Circuits: 1; Max DC Current: 3A; Depth: 0.95mm; Max Operating Temperature: 125°C; Length: 1.6mm; RoHS Compliant: Yes
U1 = CMP-0469-00059-2: as U1 on sheet IO1; ComponentLink1Description: Manufacturer URL; ComponentLink5URL: http://www.altera.com/literature/dp/cyclone-v/5CGXFC3.xls; ComponentLink7URL: http://www.buyaltera.com/scripts/partsearch.dll?Detail&name=544-2758-ND; Subcategory: Cyclone V GX; ComponentLink2Description: Datasheet; Voltage Supply: 1.07 to 1.13 V; PackageVersion: Rev. 1.0, 10/2011; ComponentLink7Description: Product URL; ComponentLink4Description: Device Handbook URL; Mounting Technology: Surface Mount; ComponentLink3URL: http://www.altera.com/devicepackaging/04R00433-00.pdf; Code_JEDEC: MO-216-BAK-1; ComponentLink1URL: http://www.altera.com; ComponentLink3Description: Package Specification; Device Group: 5CGXFC3; ComponentLink6URL: http://www.altera.com/literature/hb/cyclone-v/cv_51001.pdf; ComponentLink4URL: http://www.altera.com/literature/hb/cyclone-v/cyclone5_handbook.pdf; PackageDescription: 324-Pin Ultra FineLine Ball-Grid Array (UBGA), Body 15 x 15 mm, Pitch 0.8 mm; RoHS: RoHS Compliant; PackageReference: UBGA324_A-150; DatasheetVersion: Rev. 3.4; PartNumber: 5CGXFC3B7U15C8N; ComponentLink2URL: http://www.altera.com/literature/hb/cyclone-v/cv_51002.pdf; ComponentLink6Description: Device Overview URL; ComponentLink5Description: Device Pin-Out URL; NexusDeviceID: 5CGXFC3B7U15C8N
U5 = CMP-209535-000001-1: as U2 on sheet IO1; Height: 1.8mm; Package: AMS1117; Device Class L2: Power Management ICs; ComponentLink2Description: Datasheet; ComponentLink2URL: http://www.advanced-monolithic.com/pdf/ds1117.pdf; Category: IC; RoHS: TRUE; Automotive: No; Device Class L1: Integrated Circuits (ICs); Output Current: 1A; Device Class L3: Voltage Regulators - Linear; Temperature: -40°C to +125°C; Output Voltage: 3.3V; Manufacturer Part Number: AMS1117-3.3; Temperature Range Low: -40°C; Octopart: https://octopart.com/ams1117-3.3-advanced+monolithic+systems-25899300; Lead Free: Yes; Ipc Land Pattern Name: SOT229P700X180-4; Temperature Range High: +125°C
Y2 = ECX-L37BN-200.000: as Y1 on sheet IO1; MP: ECX-L37BN-200.000; Package: SMD-6 ECS International; Purchase-URL: https://pricing.snapeda.com/search/part/ECX-L37BN-200.000/?ref=eda; Price: None; Value: *; SnapEDA_Link: https://www.snapeda.com/parts/ECX-L37BN-200.000/ECS+Inc./view-part/?ref=snap; Check_prices: https://www.snapeda.com/parts/ECX-L37BN-200.000/ECS+Inc./view-part/?ref=eda; Availability: In Stock

## Sheet CONNECTORS2.SchDoc
size A; SheetNumber: 4; SheetTotal: 7
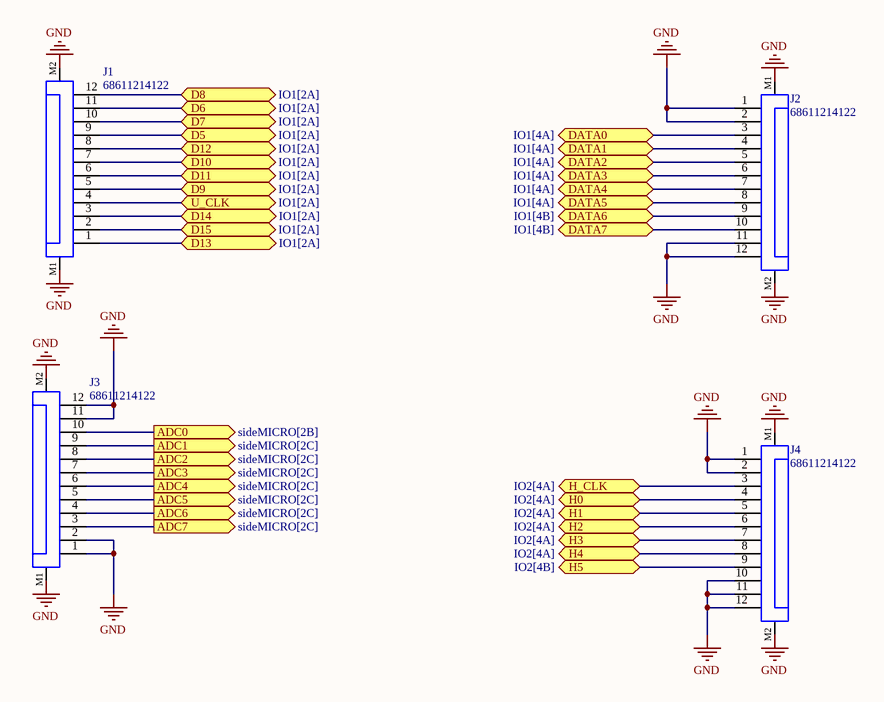
[diagram p3: CONNECTORS2.SchDoc]

### Parts
J1  68611214122  [68611214122]
J2  68611214122  [68611214122]
J3  68611214122  [68611214122]
J4  68611214122  [68611214122]

### Ports
ADC0 (out, see sideMICRO[2B]), ADC1 (out, see sideMICRO[2C]), ADC2 (out, see sideMICRO[2C]), ADC3 (out, see sideMICRO[2C]), ADC4 (out, see sideMICRO[2C]), ADC5 (out, see sideMICRO[2C]), ADC6 (out, see sideMICRO[2C]), ADC7 (out, see sideMICRO[2C]), D5 (bidir, see IO1[2A]), D6 (bidir, see IO1[2A]), D7 (bidir, see IO1[2A]), D8 (bidir, see IO1[2A]), D9 (bidir, see IO1[2A]), D10 (bidir, see IO1[2A]), D11 (bidir, see IO1[2A]), D12 (bidir, see IO1[2A]), D13 (bidir, see IO1[2A]), D14 (bidir, see IO1[2A]), D15 (bidir, see IO1[2A]), DATA0 (bidir, see IO1[4A]), DATA1 (bidir, see IO1[4A]), DATA2 (bidir, see IO1[4A]), DATA3 (bidir, see IO1[4A]), DATA4 (bidir, see IO1[4A]), DATA5 (bidir, see IO1[4A]), DATA6 (bidir, see IO1[4B]), DATA7 (bidir, see IO1[4B]), H0 (bidir, see IO2[4A]), H1 (bidir, see IO2[4A]), H2 (bidir, see IO2[4A]), H3 (bidir, see IO2[4A]), H4 (bidir, see IO2[4A]), H5 (bidir, see IO2[4B]), H_CLK (bidir, see IO2[4A]), U_CLK (bidir, see IO1[2A])

### Nets
GND: J1.M1 J1.M2 J2.1 J2.2 J2.11 J2.12 J2.M1 J2.M2 J3.1 J3.2 J3.11 J3.12 J3.M1 J3.M2 J4.1 J4.2 J4.10 J4.11 J4.12 J4.M1 J4.M2
NetJ1_1: J1.1 ; port D13
NetJ1_2: J1.2 ; port D15
NetJ1_3: J1.3 ; port D14
NetJ1_4: J1.4 ; port U_CLK
NetJ1_5: J1.5 ; port D9
NetJ1_6: J1.6 ; port D11
NetJ1_7: J1.7 ; port D10
NetJ1_8: J1.8 ; port D12
NetJ1_9: J1.9 ; port D5
NetJ1_10: J1.10 ; port D7
NetJ1_11: J1.11 ; port D6
NetJ1_12: J1.12 ; port D8
NetJ2_3: J2.3 ; port DATA0
NetJ2_4: J2.4 ; port DATA1
NetJ2_5: J2.5 ; port DATA2
NetJ2_6: J2.6 ; port DATA3
NetJ2_7: J2.7 ; port DATA4
NetJ2_8: J2.8 ; port DATA5
NetJ2_9: J2.9 ; port DATA6
NetJ2_10: J2.10 ; port DATA7
NetJ3_3: J3.3 ; port ADC7
NetJ3_4: J3.4 ; port ADC6
NetJ3_5: J3.5 ; port ADC5
NetJ3_6: J3.6 ; port ADC4
NetJ3_7: J3.7 ; port ADC3
NetJ3_8: J3.8 ; port ADC2
NetJ3_9: J3.9 ; port ADC1
NetJ3_10: J3.10 ; port ADC0
NetJ4_3: J4.3 ; port H_CLK
NetJ4_4: J4.4 ; port H0
NetJ4_5: J4.5 ; port H1
NetJ4_6: J4.6 ; port H2
NetJ4_7: J4.7 ; port H3
NetJ4_8: J4.8 ; port H4
NetJ4_9: J4.9 ; port H5

### Library data of the parts
J1-J4 = CMP-1502-01473-2: NexarPartId: 8917683; Actuator Material: Polyphenylene; Operating Supply Voltage: 125V; Number of Contacts: 12; Contact Resistance: 20mΩ; Gender: Male; Current Rating: 1A; Insulation Resistance: 100MΩ; Pitch: 1mm; Number of Rows: 1; Number of Pins: 12; REACH SVHC: Unknown; Flammability Rating: UL94 V-0; Packaging: Tape and Reel; Voltage Rating: 125V; Contact Plating: Tin; Number of Positions: 12; RoHS: Compliant; Min Operating Temperature: -25°C; Termination: Solder; Contact Material: Bronze, Tin; Lead Pitch: 1mm; Mount: Surface Mount; Width: 2.95mm; Max Operating Temperature: 85°C; Orientation: Horizontal; Length: 19mm; Housing Material: Polyphenylene

## Sheet sideMICRO.SchDoc
size A; SheetNumber: 5; SheetTotal: 7
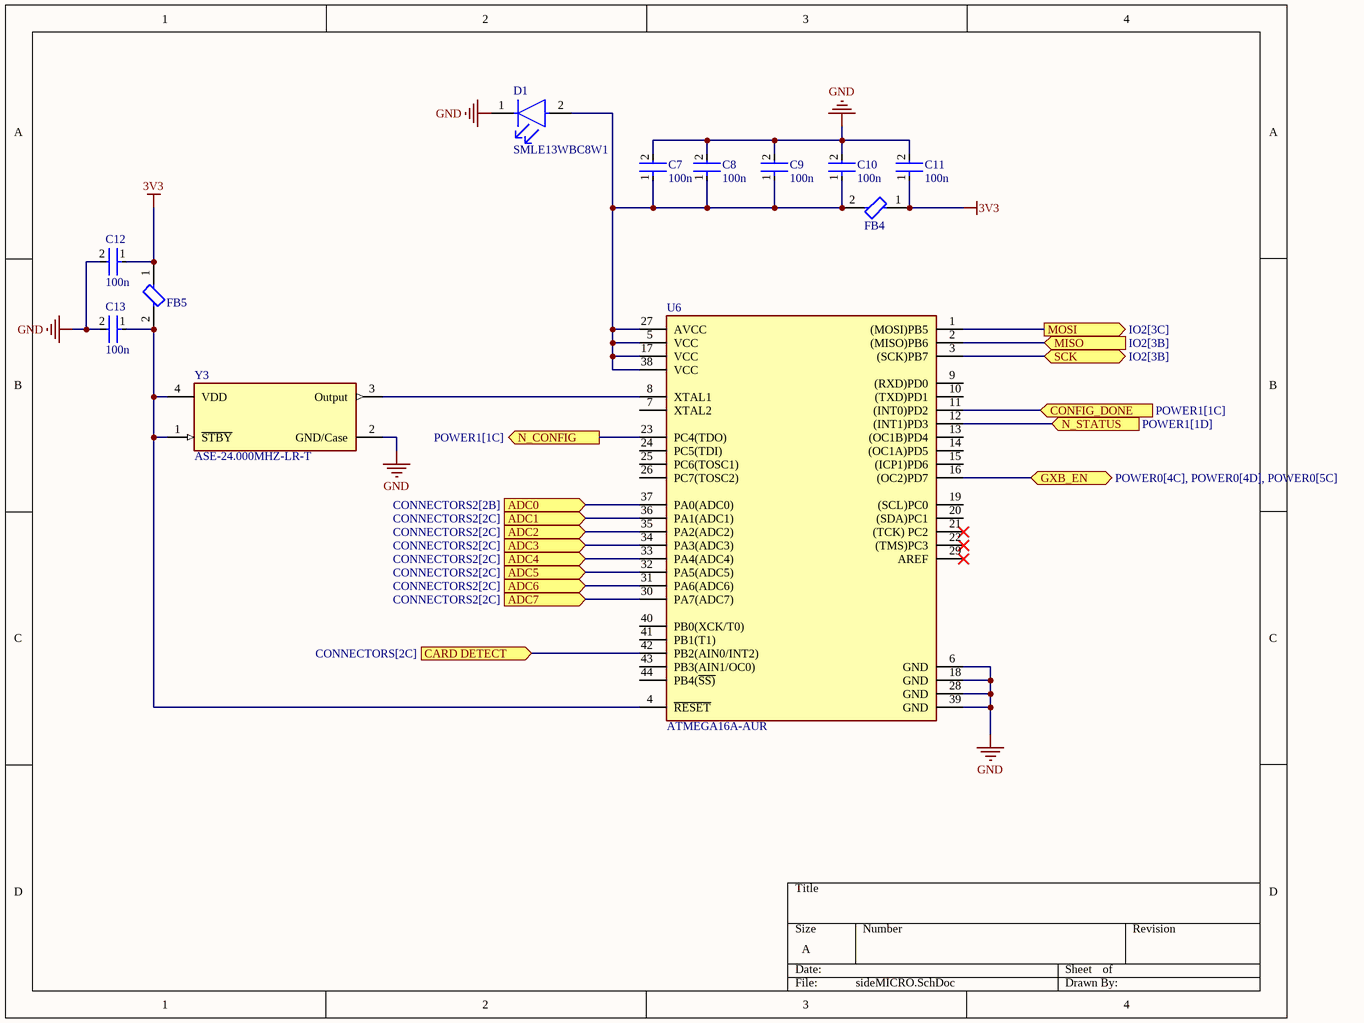
[diagram p4: sideMICRO.SchDoc]

### Parts
C7  100n  [FP-CL10-IPC_C]
C8  100n  [FP-CL10-IPC_C]
C9  100n  [FP-CL10-IPC_C]
C10  100n  [FP-CL10-IPC_C]
C11  100n  [FP-CL10-IPC_C]
C12  100n  [FP-CL10-IPC_C]
C13  100n  [FP-CL10-IPC_C]
D1  SMLE13WBC8W1  [FP-SMLE13WBC8W1-MFG]
FB4  BLM18KG121TN1D  [FP-BLM18-0_15-t0_6-d1_2-IPC_A]  (value not drawn)
FB5  BLM18KG121TN1D  [FP-BLM18-0_15-t0_6-d1_2-IPC_A]  (value not drawn)
U6  ATMEGA16A-AUR  [FP-44A-MFG]
Y3  ASE-24.000MHZ-LR-T  [FP-ASE-MFG]

### Ports
ADC0 (in, see CONNECTORS2[2B]), ADC1 (in, see CONNECTORS2[2C]), ADC2 (in, see CONNECTORS2[2C]), ADC3 (in, see CONNECTORS2[2C]), ADC4 (in, see CONNECTORS2[2C]), ADC5 (in, see CONNECTORS2[2C]), ADC6 (in, see CONNECTORS2[2C]), ADC7 (in, see CONNECTORS2[2C]), CARD DETECT (in, see CONNECTORS[2C]), CONFIG_DONE (in, see POWER1[1C]), GXB_EN (bidir, see POWER0[4C], POWER0[4D], POWER0[5C]), MISO (in, see IO2[3B]), MOSI (out, see IO2[3C]), N_CONFIG (out, see POWER1[1C]), N_STATUS (in, see POWER1[1D]), SCK (bidir, see IO2[3B])

### Nets
3V3: C11.1 C12.1 FB4.1 FB5.1  [project net VCCIO]
GND: C7.2 C8.2 C9.2 C10.2 C11.2 C12.2 C13.2 D1.1(C) U6.6(GND) U6.18(GND) U6.28(GND) U6.39(GND) Y3.2(GND/Case)
NetC7_1: C7.1 C8.1 C9.1 C10.1 D1.2(A) FB4.2 U6.5(VCC) U6.17(VCC) U6.27(AVCC) U6.38(VCC)
NetC13_1: C13.1 FB5.2 U6.4(~{RESET}) Y3.1(~{STBY}) Y3.4(VDD)
NetJ3_3: U6.30(PA7(ADC7)) ; port ADC7
NetJ3_4: U6.31(PA6(ADC6)) ; port ADC6
NetJ3_5: U6.32(PA5(ADC5)) ; port ADC5
NetJ3_6: U6.33(PA4(ADC4)) ; port ADC4
NetJ3_7: U6.34(PA3(ADC3)) ; port ADC3
NetJ3_8: U6.35(PA2(ADC2)) ; port ADC2
NetJ3_9: U6.36(PA1(ADC1)) ; port ADC1
NetJ3_10: U6.37(PA0(ADC0)) ; port ADC0
NetJ8_10: U6.42(PB2(AIN0/INT2)) ; port CARD DETECT
NetU1_C6: U6.11((INT0)PD2) ; port CONFIG_DONE
NetU1_D4: U6.23(PC4(TDO)) ; port N_CONFIG
NetU1_D6: U6.12((INT1)PD3) ; port N_STATUS
NetU1_F14: U6.3((SCK)PB7) ; port SCK
NetU1_H17: U6.2((MISO)PB6) ; port MISO
NetU1_J18: U6.1((MOSI)PB5) ; port MOSI
NetU6_8: U6.8(XTAL1) Y3.3(Output)
NetU6_16: U6.16((OC2)PD7) ; port GXB_EN

Not connected (* = marked no-connect by the designer): U6 7(XTAL2) 9((RXD)PD0) 10((TXD)PD1) 13((OC1B)PD4) 14((OC1A)PD5) 15((ICP1)PD6) 19((SCL)PC0) 20((SDA)PC1) 21((TCK)_PC2)* 22((TMS)PC3)* 24(PC5(TDI)) 25(PC6(TOSC1)) 26(PC7(TOSC2)) 29(AREF)* 40(PB0(XCK/T0)) 41(PB1(T1)) 43(PB3(AIN1/OC0)) 44(PB4(~{SS)})

### Library data of the parts
C7-C13 = CMP-13271-003017-1: as C1 on sheet IO1; Capacitance: 4.7uF; Case/Package: 0603; Packaging: Tape and Reel; Width: 0.031inch; Contact Plating: Tin; Thickness: 0.035inch; Package Quantity: 1; Voltage Rating: 10V; Case Code (Metric): 1608; Case Code (Imperial): 0603; Depth: 0.8mm; Height: 0.8mm; Tolerance: 10%; Max Operating Temperature: 85°C; Length: 1.6mm; Dielectric: X5R; Mount: Surface Mount; Radiation Hardening: No; Min Operating Temperature: -55°C
D1 = CMP-08952-000004-1: LED WHITE 0603 SMD; Manufacturer: Rohm; Luminous Intensity: 140mcd; Led Orientation: Top View; Reverse Voltage: 5V; Forward Voltage: 2.9V; Forward Current: 5mA; Power Dissipation: 66mW; Temperature Range Low: -40°C; Digikey Description: LED WHITE 0603 SMD; Temperature Range High: +85°C; Temperature: -40°C to +85°C; Manufacturer Part Number: SMLE13WBC8W1; Colour: White; Mouser Description: Standard LEDs - SMD ExceLED White LED 120mcd 5mA; Octopart: https://octopart.com/smle13wbc8w1-rohm-22224565; Automotive: No; Device Class L2: LEDs; Lead Free: Yes; ComponentLink2URL: https://media.digikey.com/pdf/Data%20Sheets/Rohm%20PDFs/SMLE13WBC8W1_Spec.pdf; Device Class L3: unset; Package: 0; RoHS: TRUE; Height: 0.4mm; Category: Diode; Device Class L1: Optoelectronics; ComponentLink2Description: Datasheet
FB4 FB5 = CMP-0686-00554-8: as FB1 on sheet IO1; Package Quantity: 4000; Min Operating Temperature: -55°C; Termination: SMD/SMT; REACH SVHC: No SVHC; Core Material: Ferrite; Material: Ferrite; Current Rating: 3A; Height: 0.8mm; Number of Pins: 2; Case/Package: 0603; Case Code (Imperial): 0603; Series: BLM18K; Packaging: Tape and Reel; Inductor Type: FERRITE BEAD; Lead Free: Lead Free; Width: 0.8mm; Case Code (Metric): 1608; Number of Circuits: 1; Max DC Current: 3A; Depth: 0.95mm; Max Operating Temperature: 125°C; Length: 1.6mm; RoHS Compliant: Yes
U6 = CMP-06276-000100-1: IC MCU 8BIT 16KB FLASH 44TQFP; Core Architecture: PIC; Number of I/Os: 13; Peripherals: Brown-out Detect/Reset; Oscillator Type: External; Frequency: 4MHz; Memory Size: 896B; Memory Type: OTP; Case/Package: DIP; Packaging: Rail/Tube; Max Operating Temperature: 70°C; RoHS Compliant: Yes; Min Operating Temperature: 0°C; Series: PIC® 16C
Y3 = CMP-27762-001392-1: XTAL Oscillator 24MHz ±25ppm CMOS 3.3V 4-SMD 3.2mm x 2.5mm; Max Supply Current: 13mA; Load Capacitance: 15pF; Packaging: Tape and Reel; Case/Package: SMD/SMT; Number of Pins: 4; Max Operating Temperature: 85°C; Min Operating Temperature: -40°C; Package Quantity: 1000; Operating Supply Voltage: 3.3V; Lead Free: Lead Free; Height: 0.047inch; Frequency Stability: 25ppm; Series: ASE; Frequency: 24MHz; Length: 0.126inch; Width: 0.098inch; Mount: Surface Mount

## Sheet CONNECTORS.SchDoc
size 389 x 241 mm; SheetNumber: 6; SheetTotal: 7
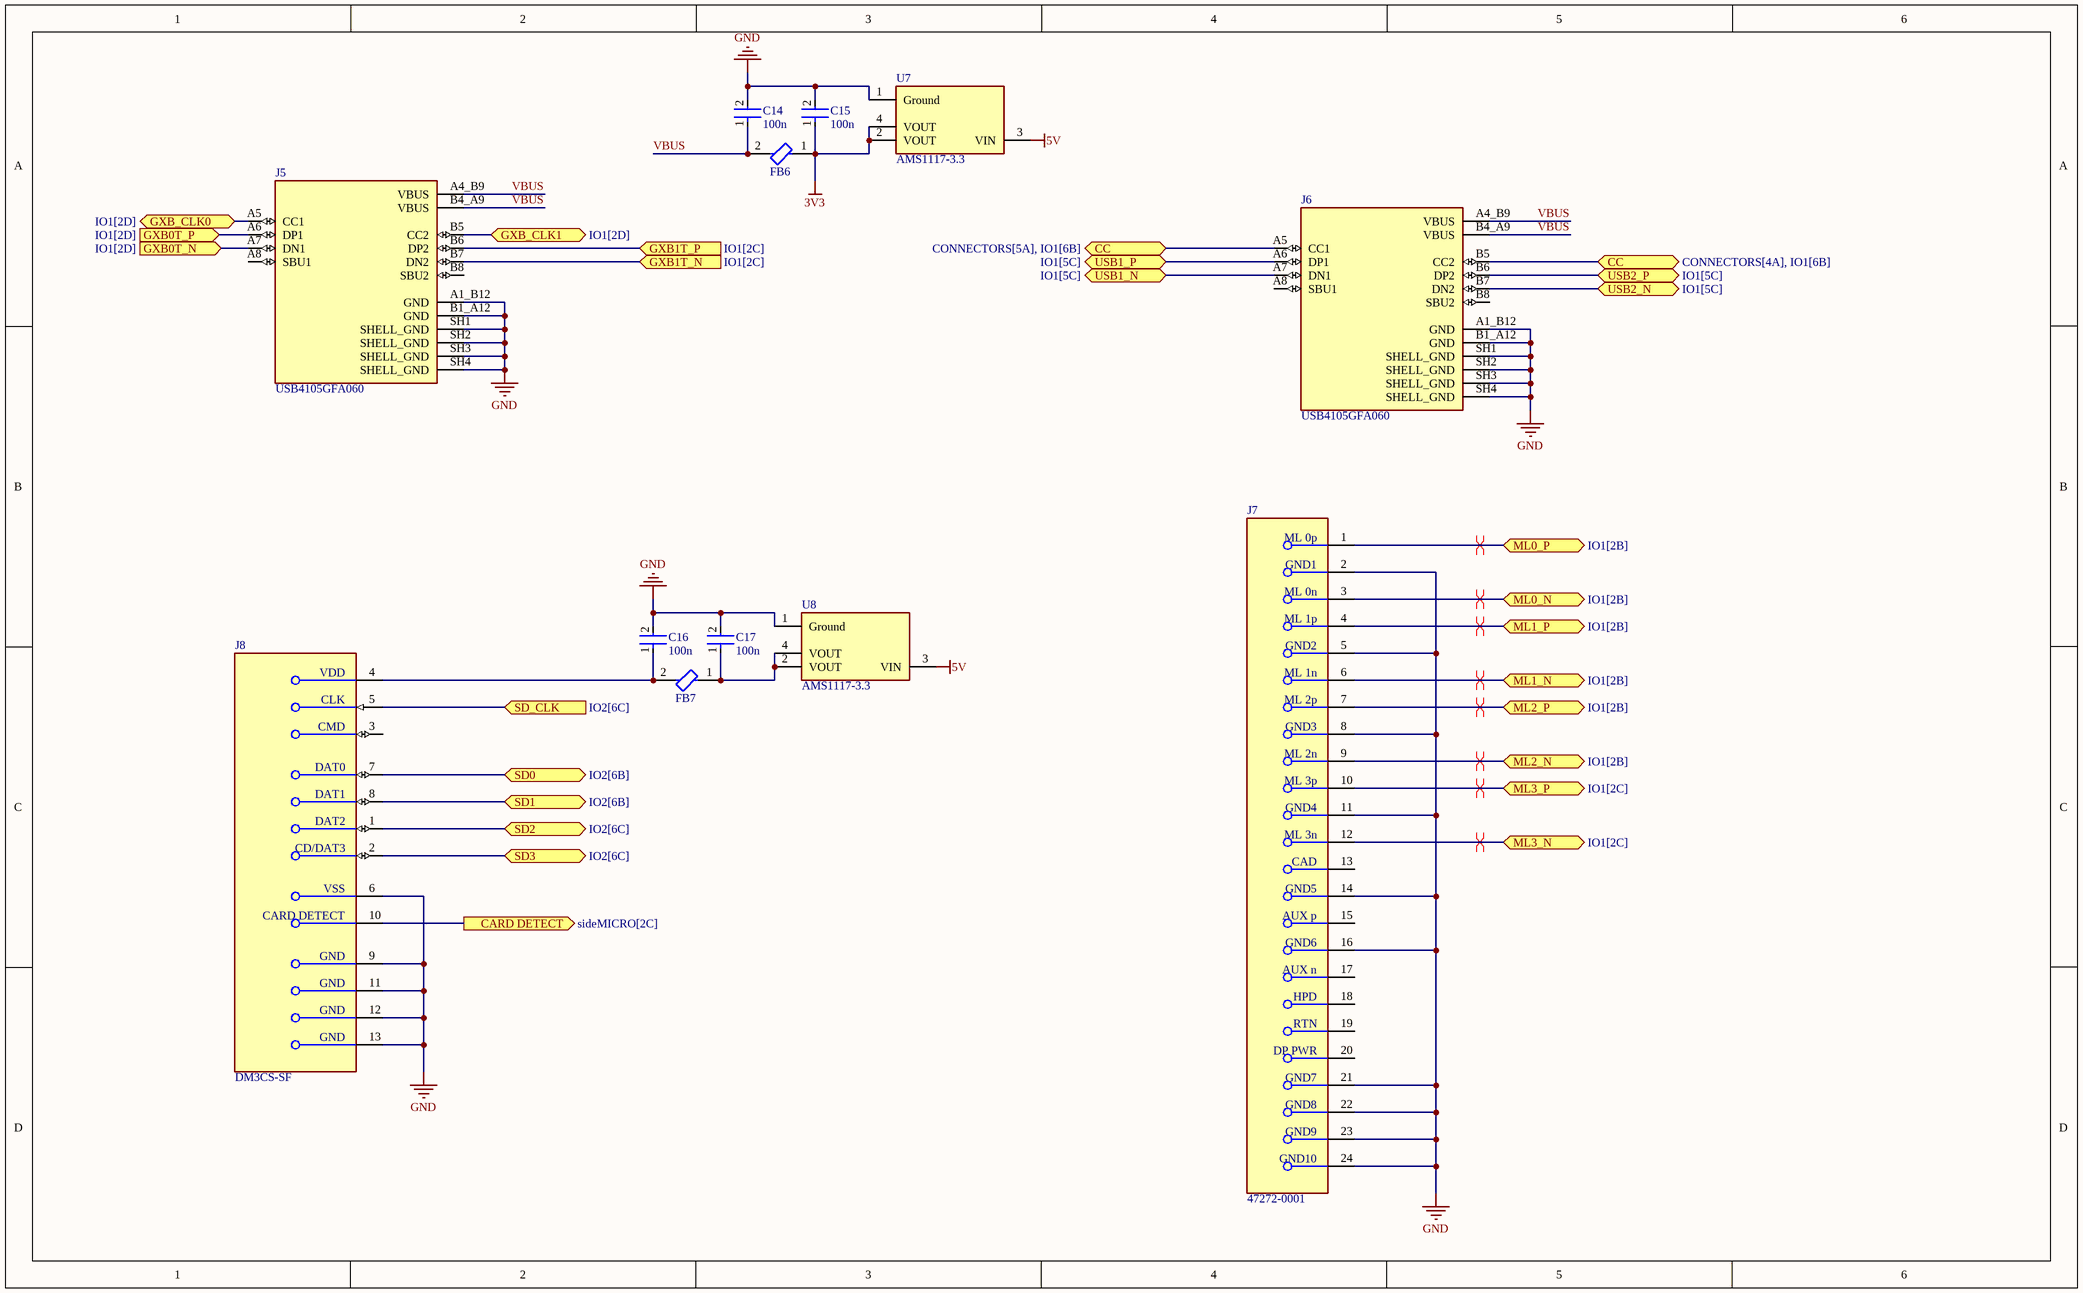
[diagram p5: CONNECTORS.SchDoc]

### Parts
C14  100n  [FP-CL10-IPC_C]
C15  100n  [FP-CL10-IPC_C]
C16  100n  [FP-CL10-IPC_C]
C17  100n  [FP-CL10-IPC_C]
FB6  BLM18KG121TN1D  [FP-BLM18-0_15-t0_6-d1_2-IPC_A]  (value not drawn)
FB7  BLM18KG121TN1D  [FP-BLM18-0_15-t0_6-d1_2-IPC_A]  (value not drawn)
J5  USB4105GFA060  [GCT_USB4105GFA060]
J6  USB4105GFA060  [GCT_USB4105GFA060]
J7  47272-0001  [FP-47272-0001-MFG]
J8  DM3CS-SF  [FP-DM3CS-SF-MFG]
U7  AMS1117-3.3  [FP-AMS1117-IPC_C]
U8  AMS1117-3.3  [FP-AMS1117-IPC_C]

### Ports
CARD DETECT (out, see sideMICRO[2C]), CC (bidir, see CONNECTORS[4A], IO1[6B]), CC (bidir, see CONNECTORS[5A], IO1[6B]), GXB0T_N (in, see IO1[2D]), GXB0T_P (in, see IO1[2D]), GXB1T_N (in, see IO1[2C]), GXB1T_P (in, see IO1[2C]), GXB_CLK0 (bidir, see IO1[2D]), GXB_CLK1 (bidir, see IO1[2D]), ML0_N (bidir, see IO1[2B]), ML0_P (bidir, see IO1[2B]), ML1_N (bidir, see IO1[2B]), ML1_P (bidir, see IO1[2B]), ML2_N (bidir, see IO1[2B]), ML2_P (bidir, see IO1[2B]), ML3_N (bidir, see IO1[2C]), ML3_P (bidir, see IO1[2C]), SD0 (bidir, see IO2[6B]), SD1 (bidir, see IO2[6B]), SD2 (bidir, see IO2[6C]), SD3 (bidir, see IO2[6C]), SD_CLK (in, see IO2[6C]), USB1_N (bidir, see IO1[5C]), USB1_P (bidir, see IO1[5C]), USB2_N (bidir, see IO1[5C]), USB2_P (bidir, see IO1[5C])

### Nets
3V3: C15.1 FB6.1 U7.2(VOUT) U7.4(VOUT)  [project net VCCIO]
5V: U7.3(VIN) U8.3(VIN)
GND: C14.2 C15.2 C16.2 C17.2 J5.A1_B12(GND) J5.B1_A12(GND) J5.SH1(SHELL_GND) J5.SH2(SHELL_GND) J5.SH3(SHELL_GND) J5.SH4(SHELL_GND) J6.A1_B12(GND) J6.B1_A12(GND) J6.SH1(SHELL_GND) J6.SH2(SHELL_GND) J6.SH3(SHELL_GND) J6.SH4(SHELL_GND) J7.2(GND1) J7.5(GND2) J7.8(GND3) J7.11(GND4) J7.14(GND5) J7.16(GND6) J7.21(GND7) J7.22(GND8) J7.23(GND9) J7.24(GND10) J8.6(VSS) J8.9(GND) J8.11(GND) J8.12(GND) J8.13(GND) U7.1(Ground) U8.1(Ground)
CLK0: J6.A5(CC1) J6.B5(CC2) ; port CC
VBUS: C14.1 FB6.2 J5.A4_B9(VBUS) J5.B4_A9(VBUS) J6.A4_B9(VBUS) J6.B4_A9(VBUS)
NetC16_1: C16.1 FB7.2 J8.4(VDD)
NetC17_1: C17.1 FB7.1 U8.2(VOUT) U8.4(VOUT)
NetJ5_A5: J5.A5(CC1) ; port GXB_CLK0
NetJ5_A6: J5.A6(DP1) ; port GXB0T_P
NetJ5_A7: J5.A7(DN1) ; port GXB0T_N
NetJ5_B5: J5.B5(CC2) ; port GXB_CLK1
NetJ5_B6: J5.B6(DP2) ; port GXB1T_P
NetJ5_B7: J5.B7(DN2) ; port GXB1T_N
NetJ6_A6: J6.A6(DP1) ; port USB1_P
NetJ6_A7: J6.A7(DN1) ; port USB1_N
NetJ6_B6: J6.B6(DP2) ; port USB2_P
NetJ6_B7: J6.B7(DN2) ; port USB2_N
NetJ7_1: J7.1(ML_0p) ; port ML0_P
NetJ7_3: J7.3(ML_0n) ; port ML0_N
NetJ7_4: J7.4(ML_1p) ; port ML1_P
NetJ7_6: J7.6(ML_1n) ; port ML1_N
NetJ7_7: J7.7(ML_2p) ; port ML2_P
NetJ7_9: J7.9(ML_2n) ; port ML2_N
NetJ7_10: J7.10(ML_3p) ; port ML3_P
NetJ7_12: J7.12(ML_3n) ; port ML3_N
NetJ8_1: J8.1(DAT2) ; port SD2
NetJ8_2: J8.2(CD/DAT3) ; port SD3
NetJ8_5: J8.5(CLK) ; port SD_CLK
NetJ8_7: J8.7(DAT0) ; port SD0
NetJ8_8: J8.8(DAT1) ; port SD1
NetJ8_10: J8.10(CARD_DETECT) ; port CARD DETECT

Not connected (* = marked no-connect by the designer): J5 A8(SBU1) B8(SBU2); J6 A8(SBU1) B8(SBU2); J7 13(CAD) 15(AUX_p) 17(AUX_n) 18(HPD) 19(RTN) 20(DP_PWR); J8 3(CMD)

### Layout directives
differential pair: NetJ7_1, NetJ7_3, NetJ7_4, NetJ7_6, NetJ7_7, NetJ7_9, NetJ7_10, NetJ7_12

### Library data of the parts
C14-C17 = CMP-13271-003017-1: as C1 on sheet IO1; Capacitance: 4.7uF; Case/Package: 0603; Packaging: Tape and Reel; Width: 0.031inch; Contact Plating: Tin; Thickness: 0.035inch; Package Quantity: 1; Voltage Rating: 10V; Case Code (Metric): 1608; Case Code (Imperial): 0603; Depth: 0.8mm; Height: 0.8mm; Tolerance: 10%; Max Operating Temperature: 85°C; Length: 1.6mm; Dielectric: X5R; Mount: Surface Mount; Radiation Hardening: No; Min Operating Temperature: -55°C
FB6 FB7 = CMP-0686-00554-8: as FB1 on sheet IO1; Package Quantity: 4000; Min Operating Temperature: -55°C; Termination: SMD/SMT; REACH SVHC: No SVHC; Core Material: Ferrite; Material: Ferrite; Current Rating: 3A; Height: 0.8mm; Number of Pins: 2; Case/Package: 0603; Case Code (Imperial): 0603; Series: BLM18K; Packaging: Tape and Reel; Inductor Type: FERRITE BEAD; Lead Free: Lead Free; Width: 0.8mm; Case Code (Metric): 1608; Number of Circuits: 1; Max DC Current: 3A; Depth: 0.95mm; Max Operating Temperature: 125°C; Length: 1.6mm; RoHS Compliant: Yes
J5 J6 = USB4105GFA060: MF: {'manufacturer': u'GCT'}; Package: None; Price: None; Value: *; MP: USB4105GFA060; Availability: Unavailable
J7 = CMP-2000-05608-2: CONN RCPT DISPLAYPORT 20P SMD RA; Manufacturer: Molex; Voltage Rating: 40V; Is Female: yes; Shielding: true; Number Of Contacts: 20; Conn Orientation: Right Angle; Current Rating: 0.5A; Pitch: 0.5mm; Device Class L2: Audio / Video Connectors; Temperature: -20°C to +85°C; Contact Material: Gold,Nickel; Footprint Url: https://www.molex.com/pdm_docs/sd/472720001_sd.pdf; Device Class L1: Connectors; ComponentLink2Description: Datasheet; Temperature Range Low: -20°C; Automotive: No; Package: 0; Height: 6.9mm; RoHS: TRUE; Octopart: https://octopart.com/47272-0001-molex-5441289; Lead Free: Yes; ComponentLink2URL: https://www.molex.com/webdocs/datasheets/pdf/en-us/0472720001_IO_CONNECTORS.pdf; Device Class L3: unset; Mouser Description: HDMI, Displayport & DVI Connectors .5MM RA SMT RCPT; Category: Conn; Manufacturer Part Number: 47272-0001; Digikey Description: CONN RCPT DISPLAYPORT 20P SMD RA; Temperature Range High: +85°C
J8 = CMP-11597-000003-1: CONN MICRO SD CARD HINGED TYPE; Pitch: 1.1mm; Connector Type: Connector; Current Rating: 500mA; Voltage Rating (AC): 125V; Gender: Female; Insulation Resistance: 1GR; Number of Positions: 8; Contact Resistance: 100mR; Packaging: Tape and Reel; Flammability Rating: UL94 V-0; Lead Free: Lead Free; Min Operating Temperature: -25°C; Orientation: Right Angle; Width: 13.8mm; Number of Rows: 1; Housing Material: Polymer; Package Quantity: 1; Mount: Surface Mount; Max Current Rating: 500mA; Radiation Hardening: No; Max Operating Temperature: 85°C; Contact Plating: Gold; Depth: 1.83mm; Contact Material: Gold; Length: 14.1mm; Number of Contacts: 8; Termination: Solder
U7 U8 = CMP-209535-000001-1: as U2 on sheet IO1; Height: 1.8mm; Package: AMS1117; Device Class L2: Power Management ICs; ComponentLink2Description: Datasheet; ComponentLink2URL: http://www.advanced-monolithic.com/pdf/ds1117.pdf; Category: IC; RoHS: TRUE; Automotive: No; Device Class L1: Integrated Circuits (ICs); Output Current: 1A; Device Class L3: Voltage Regulators - Linear; Temperature: -40°C to +125°C; Output Voltage: 3.3V; Manufacturer Part Number: AMS1117-3.3; Temperature Range Low: -40°C; Octopart: https://octopart.com/ams1117-3.3-advanced+monolithic+systems-25899300; Lead Free: Yes; Ipc Land Pattern Name: SOT229P700X180-4; Temperature Range High: +125°C